# EAGLE schematic Dashboard Test rev0 (EAGLE 7.6.0)

## Sheet 1 of 2

## Sheet 2 of 2
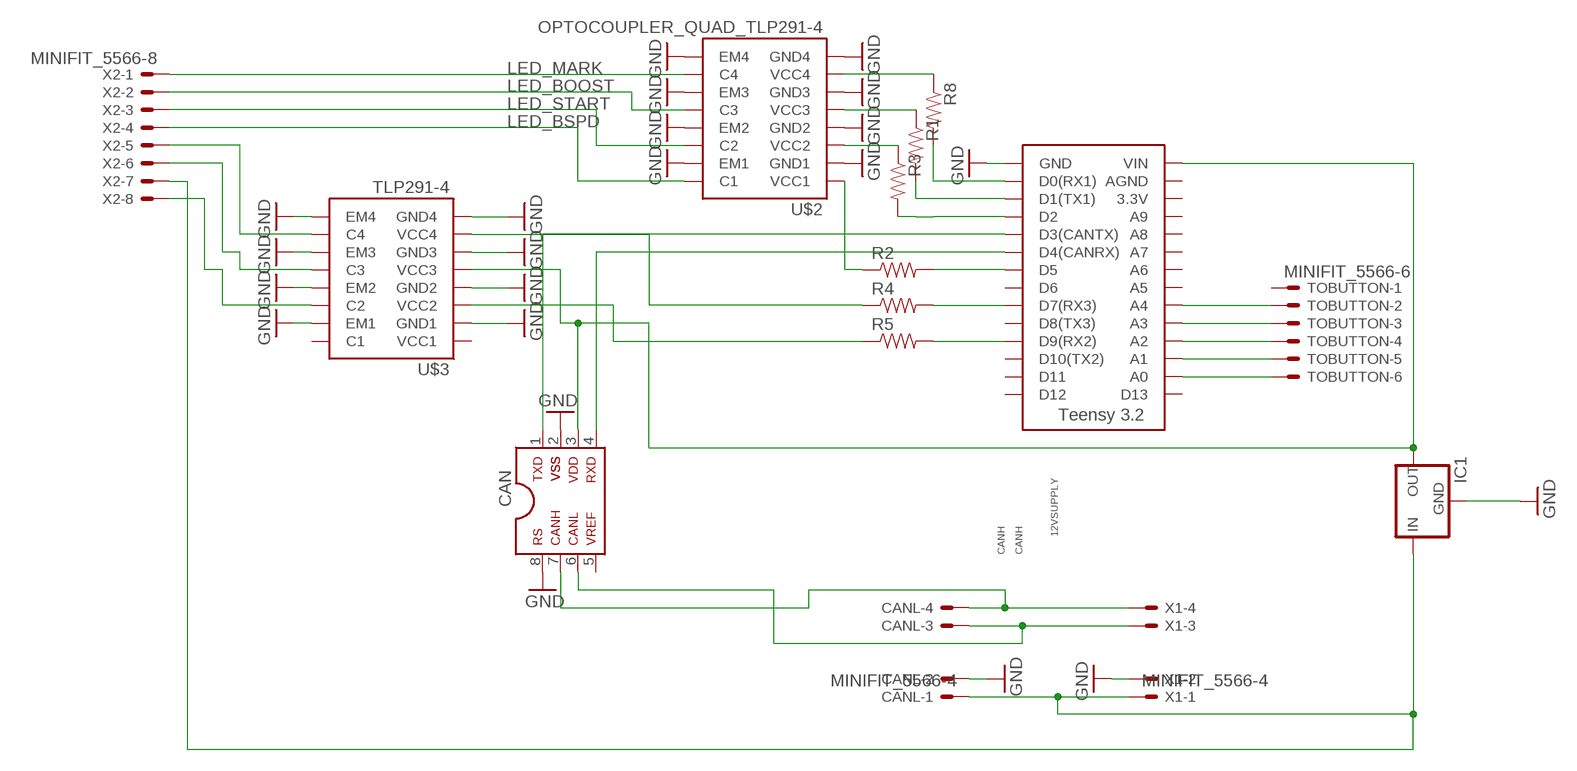
[diagram p0: schematic, sheet 2]

### Parts
CAN  MCP2551SOIC  [SOIC08]
CANL  MINIFIT_5566-4  [MINIFIT_5566-4]
IC1  5V_REGULATOR_LM340-NLM340MPX-5.0/NOPB  [SOT223]
R1  RESISTORAXIAL-0.3  [AXIAL-0.3]
R2  RESISTORAXIAL-0.3  [AXIAL-0.3]
R3  RESISTORAXIAL-0.3  [AXIAL-0.3]
R4  RESISTORAXIAL-0.3  [AXIAL-0.3]
R5  RESISTORAXIAL-0.3  [AXIAL-0.3]
R8  RESISTORAXIAL-0.3  [AXIAL-0.3]
TOBUTTON  MINIFIT_5566-6  [MINIFIT_5566-6]
U$1  TEENSY_3.2_SIMPLE  [TEENSY_3.2_SIMPLE]
U$2  OPTOCOUPLER_QUAD_TLP291-4  [SO-16]
U$3  TLP291-4  [SOIC-16]
X1  MINIFIT_5566-4  [MINIFIT_5566-4]
X2  MINIFIT_5566-8  [MINIFIT_5566-8]

### Nets
12VSUPPLY: CANL.1 IC1.1(IN) X1.1 X2.7
BOOST: TOBUTTON.3 U$1.A3
BUZZER: U$3.14(C2) X2.8
CANH: CAN.6 CANL.3 X1.3
CANL: CAN.7 CANL.4 X1.4
GND: CAN.2 CAN.8 CANL.2 IC1.2(GND) IC1.4(GND) U$1.GND U$2.2(GND1) U$2.4(GND2) U$2.6(GND3) U$2.8(GND4) U$2.9(EM4) U$2.11(EM3) U$2.13(EM2) U$2.15(EM1) U$3.2(GND1) U$3.4(GND2) U$3.6(GND3) U$3.8(GND4) U$3.9(EM4) U$3.11(EM3) U$3.13(EM2) U$3.15(EM1) X1.2
LED_BMS: U$3.12(C3) X2.6
LED_BOOST: U$2.12(C3) X2.2
LED_BSPD: U$2.16(C1) X2.4
LED_IMD: U$3.10(C4) X2.5
LED_MARK: U$2.10(C4) X2.1
LED_START: U$2.14(C2) X2.3
MARK: TOBUTTON.2 U$1.A4
N$1: R3.P$2 U$1.D2
N$2: CAN.1 U$1.D3(CANTX)
N$3: CAN.4 U$1.D4(CANRX)
N$4: R3.P$1 U$2.3(VCC2)
N$5: R1.P$2 U$1.D1(TX1)
N$7: R4.P$1 U$3.7(VCC4)
N$8: R2.P$1 U$2.1(VCC1)
N$9: R1.P$1 U$2.5(VCC3)
N$10: R8.P$2 U$1.D0(RX1)
N$11: R8.P$1 U$2.7(VCC4)
N$12: R2.P$2 U$1.D5
N$13: R4.P$2 U$1.D7(RX3)
N$14: R5.P$2 U$1.D9(RX2)
N$19: CAN.3 IC1.3(OUT) U$1.VIN U$3.5(VCC3)
N$22: R5.P$1 U$3.3(VCC2)
SELECT: TOBUTTON.6 U$1.A0
START: TOBUTTON.4 U$1.A2
TOGGLE: TOBUTTON.5 U$1.A1
Unconnected: CAN.5 TOBUTTON.1 U$1.3.3V U$1.A5 U$1.A6 U$1.A7 U$1.A8 U$1.A9 U$1.AGND U$1.D6 U$1.D8(TX3) U$1.D10(TX2) U$1.D11 U$1.D12 U$1.D13 U$3.1(VCC1) U$3.16(C1)

## Library data of the parts
CAN = HyTechDevices:MCP2551: MCP2551 High-Speed CAN Transceiver Product Webpage <https://www.microchip.com/wwwproducts/en/MCP2551> Datasheet <http://ww1.microchip.com/downloads/en/DeviceDoc/21667f.pdf> This device is outdated It is replaced by MCP2561. Comparison Page <https://www.microchip.com/wwwproducts/ProductCompare/MCP2551/MCP2561> Product Webpage <https://www.microchip.com/wwwproducts/en/MCP2561> Datasheet <http://ww1.microchip.com/downloads/en/DeviceDoc/20005167C.pdf>
CANL X1 = HyTechDevices:MINIFIT_5566-4: Mini-Fit Junior connector 4 pole Source: http://www.molex.com; OC_FARNELL: unknown; OC_NEWARK: unknown
IC1 = HyTechDevices:5V_REGULATOR_LM340-N: Voltage Regulator 5v linear voltage regulator Datasheet <http://www.mouser.com/ProductDetail/Texas-Instruments/LM340MPX-50-NOPB/?qs=X1J7HmVL2ZGZwtTFRQ9ItA%3D%3D> MAX current out: 1.5A MAX voltage in: 35V
R1-R5 R8 = HyTechDevices:RESISTOR: Resistor Basic schematic elements and footprints for 0603, 1206, and PTH resistors.
TOBUTTON = HyTechDevices:MINIFIT_5566-6: Mini-Fit Junior connector 6 pole Source: http://www.molex.com; MPN: 95566-61002; OC_FARNELL: unknown; OC_NEWARK: 22K8620
U$1 = HyTechDevices:TEENSY_3.2_SIMPLE: Simple version of the Teensy 3.2 board that only uses the 2 main rows of pins, not the inner pins or the pins opposite the usb port.
U$2 = HyTechDevices:OPTOCOUPLER_QUAD_TLP291-4
U$3 = HyTechDevices:TLP291-4: Toshiba Quad Channel Optocoupler TLP291-4
X2 = HyTechDevices:MINIFIT_5566-8: Mini-Fit Junior connector 8 pole Source: http://www.molex.com; OC_FARNELL: unknown; OC_NEWARK: unknown